# Altium schematic sheet Pump Drive.SchDoc
size A4
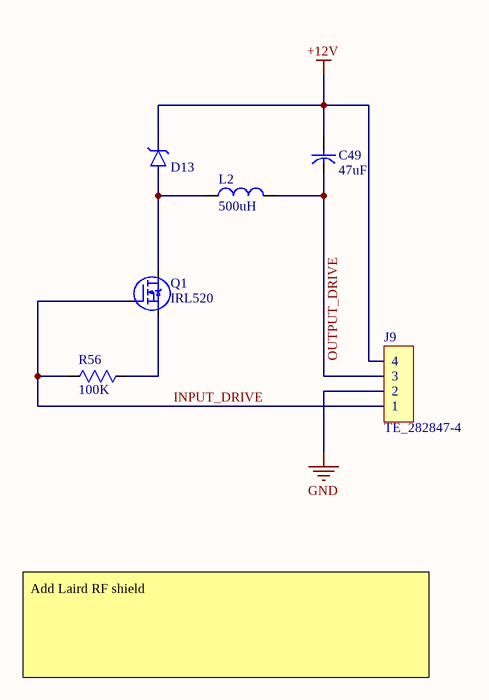
[diagram p0: Pump Drive.SchDoc]

## Parts
C49  47uF
D13  1A  [DO-41]  (value not drawn)
J9  TE_282847-4  [TE 282847-4]
L2  500uH
Q1  IRL520  [TO-220/3H]
R56  100K  [RESC14034X53N]

## Nets
+12V: C49.1 D13.1 J9.4
GND: J9.2
INPUT_DRIVE: J9.1 Q1.1(G) R56.1
OUTPUT_DRIVE: C49.2 J9.3 L2.2
NetD13_2: D13.2 L2.1 Q1.2(D)
NetQ1_3: Q1.3(S) R56.2

## Notes on the sheet
- Add Laird RF shield

## Library data of the parts
C49 = 47uF_ECL_50V: EEE-1HA470XAP; Supplier 1: Digi-Key; Supplier Part Number 1: PCE4622CT-ND
D13 = IN4007 Power Diode
J9 = TE_282847-4: TB, TH, 4-Pos, 35Deg, 5.08mm; Manufacturer: TE Connectivity AMP Connectors; Number of Levels: 1; Positions Per Level: 4; Pitch: 0.200" (5.08mm); Mating Orientation: 35° (145°) Angle with Board; Current: 17.5A; Voltage: 300V; Wire Gauge: 12-30 AWG; Wire Termination: Screw - Rising Cage Clamp; Clamp Material - Plating: Brass - Nickel Plated; Torque - Screw: 0.79 Nm (7.0 Lb-In); Screw Thread: M3; Product Training Modules: Wire-to-Board Eurostyle Terminal Blocks; Featured Product: Eurostyle Terminal Block Connectors; 3D Model: 282847-4.pdf; Dynamic Catalog: Buchanan Series; Other Names: 10550401000 / 282847-4-ND / A98350; Supplier 1: Digi-Key; Supplier Part Number 1: A98350-ND; Manufacturer Part Number: 282847-4; RoHS: RoHS Compliant; Category: Connectors, Interconnects; Stock: 10469; Pricing: 1=3.09, 10=2.342, 25=2.1712, 50=1.9522, 100=1.9045, 250=1.66644, 500=1.52364, 1000=1.38079, 2500=1.23795 (CAD); Packaging: Bulk; Part Status: Active; Mounting Type: Through Hole; Features: Interlocking (Side); Color: Green; Operating Temperature: -; Housing Material: Polyamide (PA66), Nylon 6/6; Contact Material - Plating: Brass - Tin Plated; Screw Material - Plating: Brass - Nickel Plated; ComponentLink1URL: http://www.te.com/commerce/DocumentDelivery/DDEController?Action=srchrtrv&DocNm=282847&DocType=Customer+Drawing&DocLang=English; ComponentLink1Description: http://www.te.com/commerce/DocumentDelivery/DDEController?Action=srchrtrv&DocNm=282847&DocType=Customer+Drawing&DocLang=English; Supplier 2: Arrow; Stock 2: 565; Pricing 2: 1=1.3069, 10=1.1748, 25=1.1319, 50=1.1283, 100=1.1238, 250=1.1186, 500=1.1152, 1000=1.1115, 2500=1.1043 (USD); RoHS Information: 282847-4 Statement of Compliance; Standard Package: 150; Family: Terminal Blocks - Wire to Board; Series: Buchanan; ComponentLink2URL: https://datasheet.ciiva.com/823/eng-cd-282847-d3-823896.pdf; ComponentLink2Description: https://datasheet.ciiva.com/823/eng-cd-282847-d3-823896.pdf; ComponentLink3URL: https://datasheet.ciiva.com/3141/eng-cs-1308389-eurostyle-terminal-blocks-0607-3141595.pdf; ComponentLink3Description: https://datasheet.ciiva.com/3141/eng-cs-1308389-eurostyle-terminal-blocks-0607-3141595.pdf; ComponentLink4URL: https://datasheet.ciiva.com/16676/eng-cs-1308389-eurostyle-terminal-blocks-0607-16676091.pdf; ComponentLink4Description: https://datasheet.ciiva.com/16676/eng-cs-1308389-eurostyle-terminal-blocks-0607-16676091.pdf; ComponentLink5URL: https://datasheet.ciiva.com/30108/eng-cs-1308389-eurostyle-terminal-blocks-0607-30108747.pdf; ComponentLink5Description: https://datasheet.ciiva.com/30108/eng-cs-1308389-eurostyle-terminal-blocks-0607-30108747.pdf; Supplier Part Number 2: 282847-4
L2 = 500uH_2A_THD: 1536Y; Supplier 1: Digi-Key; Supplier 2: Mouser; Supplier 3: Arrow; Supplier 4: Allied Electronics; Supplier Part Number 1: HM3330-ND; Supplier Part Number 2: 546-1536Y; Supplier Part Number 3: 1536Y; Supplier Part Number 4: 70181029
Q1 = IRL540: Power MOSFET; Value: *; Type: *; Mfg.: *; Supplier: *; Part#: *; Price: *; Notes: *
R56 = 100k_10555_3W: Res,SMD,10555,3W,5%; Supplier 1: Digi-Key; Supplier 2: Mouser; Supplier Part Number 1: A103553CT-ND; Supplier Part Number 2: 279-SMF3100KJT